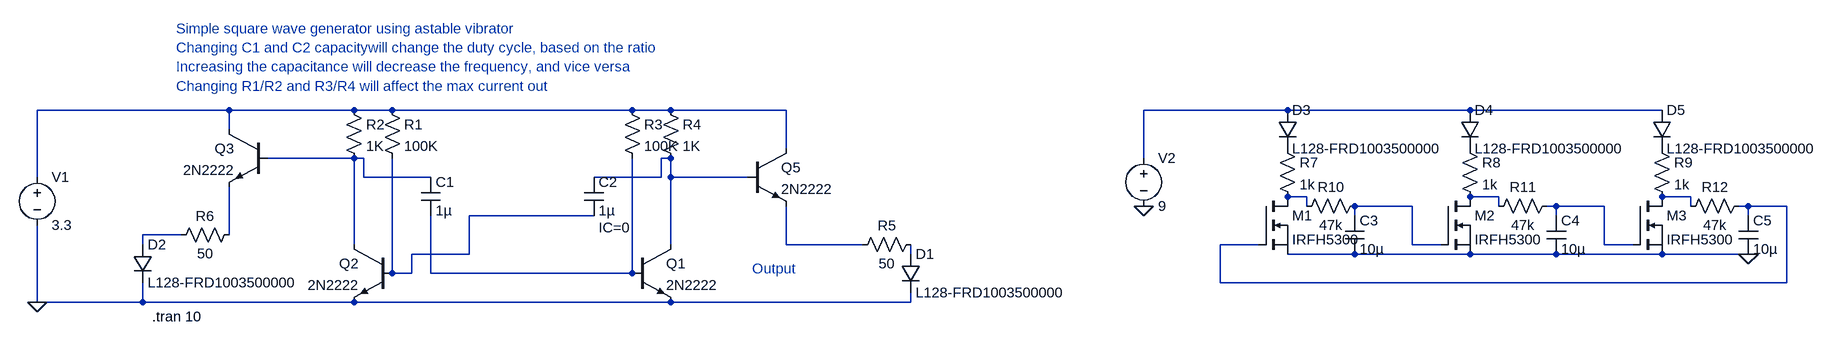
[diagram p0: schematic oscillator.asc]
oscillator.asc, the LTspice schematic file:
Version 4.1
SHEET 1 2652 680
WIRE -624 -144 -944 -144
WIRE -416 -144 -624 -144
WIRE -352 -144 -416 -144
WIRE 48 -144 -352 -144
WIRE 112 -144 48 -144
WIRE 304 -144 112 -144
WIRE 1760 -144 1520 -144
WIRE 2064 -144 1760 -144
WIRE 2384 -144 2064 -144
WIRE -624 -112 -624 -144
WIRE 304 -80 304 -144
WIRE -416 -64 -560 -64
WIRE -400 -64 -416 -64
WIRE 112 -64 96 -64
WIRE 1520 -64 1520 -144
WIRE -944 -32 -944 -144
WIRE -400 -32 -400 -64
WIRE -288 -32 -400 -32
WIRE 96 -32 96 -64
WIRE 96 -32 -16 -32
WIRE 112 -32 112 -64
WIRE 240 -32 112 -32
WIRE 1792 0 1760 0
WIRE 2112 0 2064 0
WIRE 2432 0 2384 0
WIRE 1792 16 1792 0
WIRE 1968 16 1872 16
WIRE 2112 16 2112 0
WIRE 2208 16 2192 16
WIRE 2288 16 2208 16
WIRE 2432 16 2432 0
WIRE 2528 16 2512 16
WIRE 2592 16 2528 16
WIRE -16 32 -224 32
WIRE 1872 32 1872 16
WIRE 2208 32 2208 16
WIRE 2528 32 2528 16
WIRE -704 64 -768 64
WIRE -624 64 -624 -16
WIRE -768 80 -768 64
WIRE -416 80 -416 -64
WIRE 112 80 112 -32
WIRE 304 80 304 16
WIRE 432 80 304 80
WIRE 1712 80 1648 80
WIRE 1968 80 1968 16
WIRE 2016 80 1968 80
WIRE 2288 80 2288 16
WIRE 2336 80 2288 80
WIRE -224 96 -224 32
WIRE -224 96 -320 96
WIRE 512 96 512 80
WIRE 1872 96 1760 96
WIRE 2064 96 1872 96
WIRE 2208 96 2064 96
WIRE 2384 96 2208 96
WIRE 2528 96 2384 96
WIRE -352 128 -352 -64
WIRE -352 128 -368 128
WIRE -320 128 -320 96
WIRE -320 128 -352 128
WIRE -288 128 -288 32
WIRE 48 128 48 -64
WIRE 48 128 -288 128
WIRE 1648 144 1648 80
WIRE 2592 144 2592 16
WIRE 2592 144 1648 144
WIRE -944 176 -944 48
WIRE -768 176 -768 144
WIRE -768 176 -944 176
WIRE -416 176 -768 176
WIRE 112 176 -416 176
WIRE 512 176 512 160
WIRE 512 176 112 176
FLAG -944 176 0
FLAG 2528 96 0
FLAG 1520 16 0
SYMBOL npn 48 80 R0
SYMATTR InstName Q1
SYMATTR Value 2N2222
SYMBOL npn -352 80 M0
SYMATTR InstName Q2
SYMATTR Value 2N2222
SYMBOL res -368 -160 R0
SYMATTR InstName R1
SYMATTR Value 100K
SYMATTR SpiceLine tol=1 pwr=500m
SYMBOL res -432 -160 R0
SYMATTR InstName R2
SYMATTR Value 1K
SYMATTR SpiceLine tol=1 pwr=500m
SYMBOL res 32 -160 R0
SYMATTR InstName R3
SYMATTR Value 100K
SYMATTR SpiceLine tol=1 pwr=500m
SYMBOL res 96 -160 R0
SYMATTR InstName R4
SYMATTR Value 1K
SYMATTR SpiceLine tol=1 pwr=500m
SYMBOL cap -304 -32 R0
WINDOW 39 24 84 Left 2
SYMATTR InstName C1
SYMATTR Value 1µ
SYMBOL cap -32 -32 R0
WINDOW 123 24 84 Left 2
SYMATTR Value2 IC=0
SYMATTR InstName C2
SYMATTR Value 1µ
SYMBOL voltage -944 -48 R0
WINDOW 123 0 0 Left 0
WINDOW 39 0 0 Left 0
SYMATTR InstName V1
SYMATTR Value 3.3
SYMBOL npn 240 -80 R0
SYMATTR InstName Q5
SYMATTR Value 2N2222
SYMBOL res 528 64 R90
WINDOW 0 0 56 VBottom 2
WINDOW 3 32 56 VTop 2
SYMATTR InstName R5
SYMATTR Value 50
SYMBOL diode 496 96 R0
SYMATTR InstName D1
SYMATTR Value L128-FRD1003500000
SYMATTR Description Diode
SYMATTR Type diode
SYMBOL npn -560 -112 M0
SYMATTR InstName Q3
SYMATTR Value 2N2222
SYMBOL res -720 80 R270
WINDOW 0 32 56 VTop 2
WINDOW 3 0 56 VBottom 2
SYMATTR InstName R6
SYMATTR Value 50
SYMBOL diode -784 80 R0
SYMATTR InstName D2
SYMATTR Value L128-FRD1003500000
SYMATTR Description Diode
SYMATTR Type diode
SYMBOL voltage 1520 -80 R0
WINDOW 123 0 0 Left 0
WINDOW 39 0 0 Left 0
SYMATTR InstName V2
SYMATTR Value 9
SYMBOL diode 1744 -144 R0
SYMATTR InstName D3
SYMATTR Value L128-FRD1003500000
SYMATTR Description Diode
SYMATTR Type diode
SYMBOL diode 2048 -144 R0
SYMATTR InstName D4
SYMATTR Value L128-FRD1003500000
SYMATTR Description Diode
SYMATTR Type diode
SYMBOL diode 2368 -144 R0
SYMATTR InstName D5
SYMATTR Value L128-FRD1003500000
SYMATTR Description Diode
SYMATTR Type diode
SYMBOL res 1744 -96 R0
SYMATTR InstName R7
SYMATTR Value 1k
SYMBOL res 2048 -96 R0
SYMATTR InstName R8
SYMATTR Value 1k
SYMBOL res 2368 -96 R0
SYMATTR InstName R9
SYMATTR Value 1k
SYMBOL nmos 1712 0 R0
SYMATTR InstName M1
SYMATTR Value IRFH5300
SYMBOL nmos 2016 0 R0
SYMATTR InstName M2
SYMATTR Value IRFH5300
SYMBOL nmos 2336 0 R0
SYMATTR InstName M3
SYMATTR Value IRFH5300
SYMBOL res 1888 0 R90
WINDOW 0 0 56 VBottom 2
WINDOW 3 32 56 VTop 2
SYMATTR InstName R10
SYMATTR Value 47k
SYMBOL cap 1856 32 R0
SYMATTR InstName C3
SYMATTR Value 10µ
SYMBOL cap 2192 32 R0
SYMATTR InstName C4
SYMATTR Value 10µ
SYMBOL cap 2512 32 R0
SYMATTR InstName C5
SYMATTR Value 10µ
SYMBOL res 2208 0 R90
WINDOW 0 0 56 VBottom 2
WINDOW 3 32 56 VTop 2
SYMATTR InstName R11
SYMATTR Value 47k
SYMBOL res 2528 0 R90
WINDOW 0 0 56 VBottom 2
WINDOW 3 32 56 VTop 2
SYMATTR InstName R12
SYMATTR Value 47k
TEXT -752 200 Left 2 !.tran 10
TEXT 248 120 Left 2 ;Output
TEXT -712 -248 Left 2 ;Changing C1 and C2 capacitywill change the duty cycle, based on the ratio
TEXT -712 -280 Left 2 ;Simple square wave generator using astable vibrator
TEXT -712 -184 Left 2 ;Changing R1/R2 and R3/R4 will affect the max current out
TEXT -712 -216 Left 2 ;Increasing the capacitance will decrease the frequency, and vice versa

The netlist it stands for:
* oscillator.asc
Q1 N004 N016 0 0 2N2222
Q2 N003 N011 0 0 2N2222
R1 N001 N011 100K tol=1 pwr=500m
R2 N001 N003 1K tol=1 pwr=500m
R3 N001 N016 100K tol=1 pwr=500m
R4 N001 N004 1K tol=1 pwr=500m
C1 N003 N016 1µ
C2 N004 N011 1µ IC=0
V1 N001 0 3.3
Q5 N001 N004 N014 0 2N2222
R5 N015 N014 50
D1 N015 0 L128-FRD1003500000
Q3 N001 N003 N013 0 2N2222
R6 N012 N013 50
D2 N012 0 L128-FRD1003500000
V2 N002 0 9
D3 N002 P001 L128-FRD1003500000
D4 N002 P002 L128-FRD1003500000
D5 N002 P003 L128-FRD1003500000
R7 P001 N005 1k
R8 P002 N006 1k
R9 P003 N007 1k
M1 N005 N010 0 0 IRFH5300
M2 N006 N008 0 0 IRFH5300
M3 N007 N009 0 0 IRFH5300
R10 N008 N005 47k
C3 N008 0 10µ
C4 N009 0 10µ
C5 N010 0 10µ
R11 N009 N006 47k
R12 N010 N007 47k
.model D D
.lib standard.dio
.model NPN NPN
.model PNP PNP
.lib standard.bjt
.model NMOS NMOS
.model PMOS PMOS
.lib standard.mos
.tran 10
* Output
* Changing C1 and C2 capacitywill change the duty cycle, based on the ratio
* Simple square wave generator using astable vibrator
* Changing R1/R2 and R3/R4 will affect the max current out
* Increasing the capacitance will decrease the frequency, and vice versa
.backanno
.end